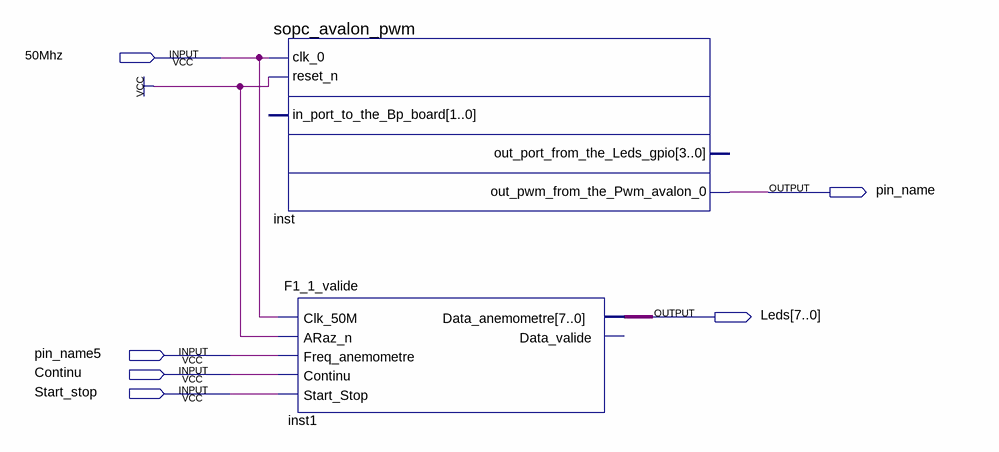
[diagram p0: schematic sheet]
// Quartus schematic mon_sopc_avalon_pwm.bdf as structural Verilog: 2 symbols, 6 pins
module mon_sopc_avalon_pwm (
  input  \50Mhz ,
  input  pin_name5,
  input  Continu,
  input  Start_stop,
  output pin_name,
  output [7:0] Leds
);

  sopc_avalon_pwm inst (
    .clk_0(\50Mhz ), .reset_n(1'b1), .out_pwm_from_the_Pwm_avalon_0(pin_name));  // open: in_port_to_the_Bp_board, out_port_from_the_Leds_gpio
  F1_1_valide inst1 (
    .Clk_50M(\50Mhz ), .ARaz_n(1'b1), .Freq_anemometre(pin_name5), .Continu(Continu),
    .Start_Stop(Start_stop), .Data_anemometre(Leds));  // open: Data_valide
endmodule
